# Altium schematic sheet MCU.SchDoc: Top Level
size A3; CompanyName: NOT USED; DocumentNumber: 2; SheetNumber: 2; SheetTotal: 5; PageSetup: Record=PageOptions|CenterHorizontal=True|CenterVertical=True|PrintScale=1.00|XCorrection=1.00|YCorrection=1.00|PrintKind=0|BorderSize=5000000|LeftOffset=0|BottomOffset=0|Orientation=2|PaperLength=1000|PaperWidth=1000|Scale=100|PaperSource=7|PrintQuality=-4|MediaType=1|DitherType=10|PaperKind=A3|PrintScaleMode=0
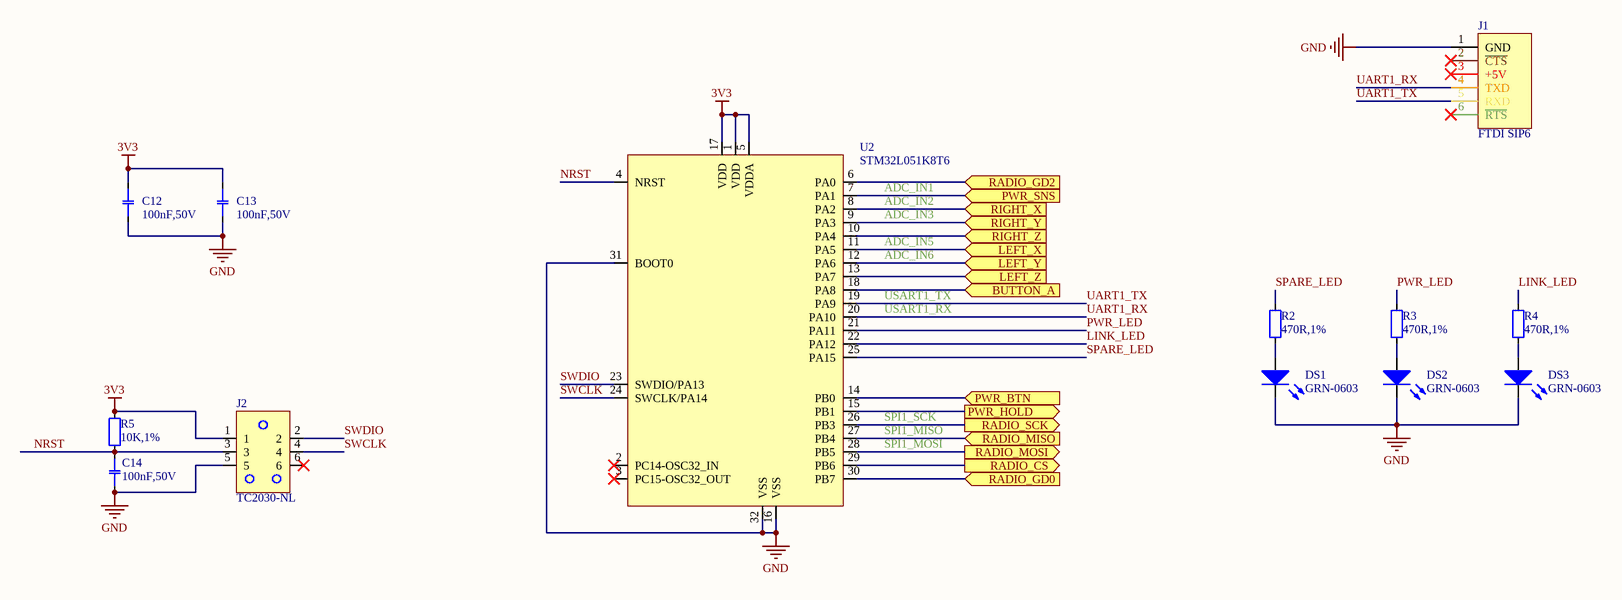
[diagram p0: MCU.SchDoc]

## Parts
C12  100nF,50V  [CAPC1608X09N_0603]
C13  100nF,50V  [CAPC1608X09N_0603]
C14  100nF,50V  [CAPC1608X09N_0603]
DS1  GRN-0603  [LED_SML-LX0603]
DS2  GRN-0603  [LED_SML-LX0603]
DS3  GRN-0603  [LED_SML-LX0603]
J1  FTDI SIP6  [HIROSE_A2-6PA-2.54DSA]
J2  TC2030-NL  [TAGCON_TC2030-IDC-NL]  (no BOM)
R2  470R,1%  [RESC1608X06N_0603]
R3  470R,1%  [RESC1608X06N_0603]
R4  470R,1%  [RESC1608X06N_0603]
R5  10K,1%  [RESC1608X06N_0603]
U2  STM32L051K8T6  [LQFP32]

## Ports
BUTTON_A (in), LEFT_X (in), LEFT_Y (in), LEFT_Z (in), PWR_BTN (in), PWR_HOLD (out), PWR_SNS (in), RADIO_CS (out), RADIO_GD0 (in), RADIO_GD2 (in), RADIO_MISO (in), RADIO_MOSI (out), RADIO_SCK (out), RIGHT_X (in), RIGHT_Y (in), RIGHT_Z (in)

## Nets
3V3: C12.2 C13.2 J2.1 R5.2 U2.1(VDD) U2.5(VDDA) U2.17(VDD)
GND: C12.1 C13.1 C14.2 DS1.1(C) DS2.1(C) DS3.1(C) J1.1(GND) J2.5 U2.16(VSS) U2.31(BOOT0) U2.32(VSS)
BUTTON_A: U2.18(PA8) ; port BUTTON_A
LEFT_X: U2.11(PA5) ; port LEFT_X
LEFT_Y: U2.12(PA6) ; port LEFT_Y
LEFT_Z: U2.13(PA7) ; port LEFT_Z
LINK_LED: R4.2 U2.22(PA12)
NRST: C14.1 J2.3 R5.1 U2.4(NRST)
PWR_BTN: U2.14(PB0) ; port PWR_BTN
PWR_HOLD: U2.15(PB1) ; port PWR_HOLD
PWR_LED: R3.2 U2.21(PA11)
PWR_SNS: U2.7(PA1) ; port PWR_SNS
RADIO_CS: U2.29(PB6) ; port RADIO_CS
RADIO_GD0: U2.30(PB7) ; port RADIO_GD0
RADIO_GD2: U2.6(PA0) ; port RADIO_GD2
RADIO_MISO: U2.27(PB4) ; port RADIO_MISO
RADIO_MOSI: U2.28(PB5) ; port RADIO_MOSI
RADIO_SCK: U2.26(PB3) ; port RADIO_SCK
RIGHT_X: U2.8(PA2) ; port RIGHT_X
RIGHT_Y: U2.9(PA3) ; port RIGHT_Y
RIGHT_Z: U2.10(PA4) ; port RIGHT_Z
SPARE_LED: R2.2 U2.25(PA15)
SWCLK: J2.4 U2.24(SWCLK/PA14)
SWDIO: J2.2 U2.23(SWDIO/PA13)
UART1_RX: J1.4(TXD) U2.20(PA10)
UART1_TX: J1.5(RXD) U2.19(PA9)
NetDS1_2: DS1.2(A) R2.1
NetDS2_2: DS2.2(A) R3.1
NetDS3_2: DS3.2(A) R4.1

Not connected (* = marked no-connect by the designer): J1 2(~{CTS})* 3(+5V)* 6(~{RTS})*; J2 6*; U2 2(PC14-OSC32_IN)* 3(PC15-OSC32_OUT)*

## Notes on the sheet
- (near U2) ADC_IN1
- (near U2) ADC_IN2
- (near U2) ADC_IN3
- (near U2) USART1_TX
- (near U2) ADC_IN5
- (near U2) ADC_IN6
- (near U2) USART1_RX
- (near U2) SPI1_SCK
- (near U2) SPI1_MISO
- (near U2) SPI1_MOSI
- Project
- Size:
- Date:
- A3
- Revision:
- Sheet
- of
- Lambo
- File:

## Library data of the parts
C12-C14 = CCH-104CH-G: CAP CER 0.1UF 50V 10% X7R 0603; Manufacturer: Kemet; Manufacturer Part Number: C0603C104K5RACTU; Type: Ceramic; Display_Name: 100nF,50V; Capacitance: 100nF; Dielectric: X7R; Tolerance: 10%; Voltage: 50V; BWA PN: CCH-104CH-G; Schematic Symbol: CAP-NP_1; Supplier 1: Digi-Key; Supplier Part Number 1: 399-5089-1-ND
DS1-DS3 = LED-10087-A: LED GREEN CLEAR 0603 SMD; Manufacturer: Dialight; Manufacturer Part Number: 5988081107F; Wavelength: 523nm; Axial Intensity: 300mcd; If(max): 20mA; Lens Style/Size: 0603; Vf@I: 3.2V; Viewing Angle: 140; Display_Name: GRN-0603; BWA PN: LED-10087-A; Colour: GREEN; Lens type: clear; Vr(max): -; Schematic Symbol: LED_1; Supplier 1: Digi-Key; Supplier Part Number 1: 350-2036-1-ND
J1 = CON-10749-A: FTDI Serial Header; Manufacturer: Hirose Electric Co Ltd; Manufacturer Part Number: A2-6PA-2.54DSA(71); Contacts: 6; Pitch: 2.54mm; Rows: 1; Display_Name: FTDI SIP6; Type: Header; BWA PN: CON-10749-A; Schematic Symbol: FTDI_TTL_232R; Supplier 1: Digi-Key; Supplier Part Number 1: H123043-ND
J2 = NONPART-056: Tag connect 6 way - No Legs; Display_Name: TC2030-NL; BWA PN: NONPART-056; Schematic Symbol: TAGCON_TC2030-IDC
R2-R4 = RSH-470R0-D: RES 470 OHM 1/10W 1% 0603 SMD; Manufacturer: Rohm Semiconductor; Manufacturer Part Number: MCR03EZPFX4700; Power: 0.1W; Display_Name: 470R,1%; Resistance: 470R; Tolerance: 1%; Type: Chip; BWA PN: RSH-470R0-D; Schematic Symbol: RESISTOR_1; Supplier 1: Digi-Key; Supplier Part Number 1: RHM470HCT-ND
R5 = RSH-10K00-D: RES 10.0K OHM 1/10W 1% 0603 SMD; Manufacturer: Yageo; Manufacturer Part Number: RC0603FR-0710KL; Power: 0.1W; Display_Name: 10K,1%; Resistance: 10K; Tolerance: 1%; Type: Chip; BWA PN: RSH-10K00-D; Schematic Symbol: RESISTOR_1; Supplier 1: Digi-Key; Supplier Part Number 1: 311-10.0KHRCT-ND
U2 = ICT-10696-A: 32 Bit Mcirocontroler; Manufacturer: ST Microelectronics; Temp Range: -40°C ~ 85°C; Display_Name: STM32L051K8T6; BWA PN: ICT-10696-A; Schematic Symbol: STM32L051x6/8; Manufacturer Part Number: STM32L051K8T6; Supplier 1: Digi-Key; Supplier Part Number 1: 497-14901-ND